# EAGLE design ESP-3212 breakout board (EAGLE 7.4.0)
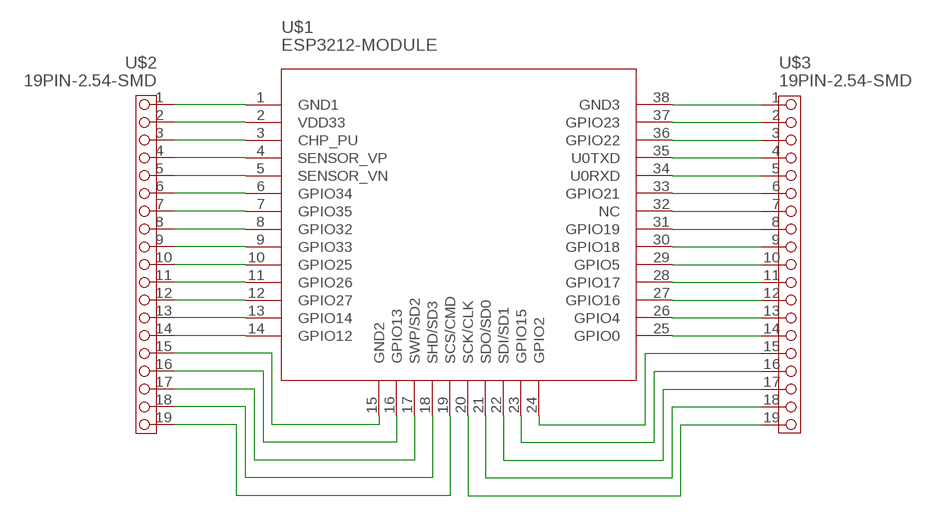
[diagram p0: schematic, sheet 1]

## Parts
U$1  ESP3212-MODULE  [ESP3212-MODULE]
U$2  19PIN-2.54-SMD  [19PIN-2.54-SMD]
U$3  19PIN-2.54-SMD  [19PIN-2.54-SMD]

## Nets
GND: U$1.1(GND1) U$1.15(GND2) U$1.38(GND3) U$2.1 U$2.15 U$3.1
N$2: U$1.2(VDD33) U$2.2
N$3: U$1.3(CHP_PU) U$2.3
N$4: U$1.4(SENSOR_VP) U$2.4
N$5: U$1.5(SENSOR_VN) U$2.5
N$6: U$1.6(GPIO34) U$2.6
N$7: U$1.7(GPIO35) U$2.7
N$8: U$1.8(GPIO32) U$2.8
N$9: U$1.9(GPIO33) U$2.9
N$10: U$1.10(GPIO25) U$2.10
N$11: U$1.11(GPIO26) U$2.11
N$12: U$1.12(GPIO27) U$2.12
N$13: U$1.13(GPIO14) U$2.13
N$14: U$1.14(GPIO12) U$2.14
N$16: U$1.16(GPIO13) U$2.16
N$17: U$1.17(SWP/SD2) U$2.17
N$18: U$1.18(SHD/SD3) U$2.18
N$19: U$1.19(SCS/CMD) U$2.19
N$21: U$1.37(GPIO23) U$3.2
N$22: U$1.36(GPIO22) U$3.3
N$23: U$1.35(U0TXD) U$3.4
N$24: U$1.34(U0RXD) U$3.5
N$25: U$1.33(GPIO21) U$3.6
N$26: U$1.32(NC) U$3.7
N$27: U$1.31(GPIO19) U$3.8
N$28: U$1.30(GPIO18) U$3.9
N$29: U$1.29(GPIO5) U$3.10
N$30: U$1.28(GPIO17) U$3.11
N$31: U$1.27(GPIO16) U$3.12
N$32: U$1.26(GPIO4) U$3.13
N$33: U$1.25(GPIO0) U$3.14
N$34: U$1.24(GPIO2) U$3.15
N$35: U$1.23(GPIO15) U$3.16
N$36: U$1.22(SDI/SD1) U$3.17
N$37: U$1.21(SDO/SD0) U$3.18
N$38: U$1.20(SCK/CLK) U$3.19

## Library data of the parts
U$1 = Bobby:ESP3212-MODULE
U$2 U$3 = Bobby:19PIN-2.54-SMD

## Net classes
2 gnd: width 0.305 mm, drill 0.559 mm, clearance 0.254 mm

## Board
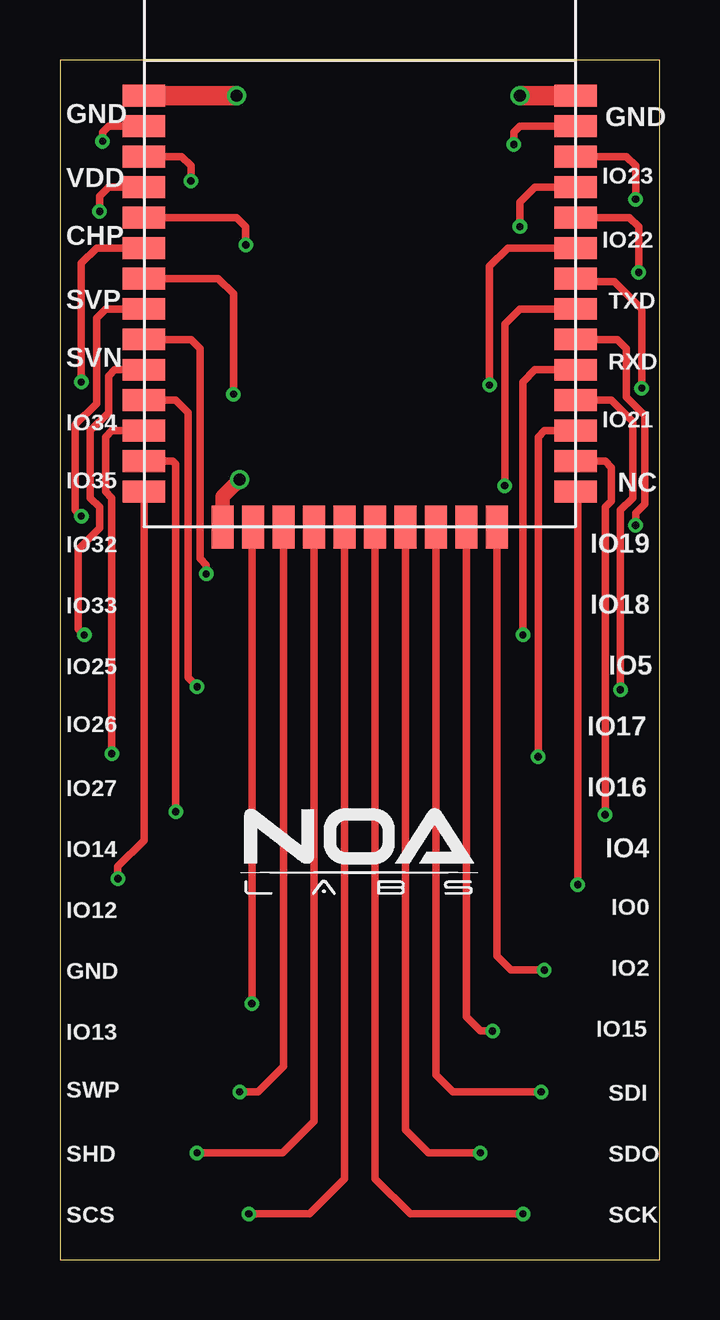
[diagram p1: board, top side]
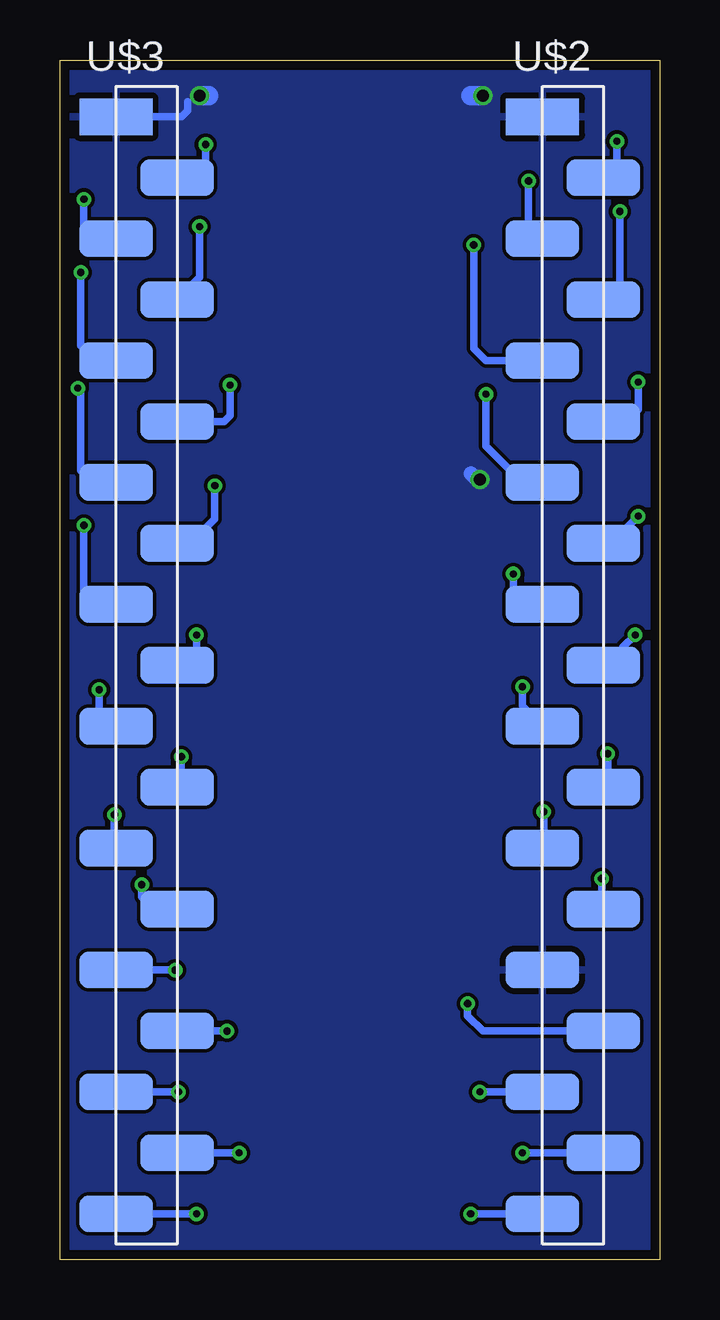
[diagram p2: board, bottom side, seen from below]

Size 25 x 50 mm. Coordinates in mm from the lower left corner, seen from the top.
Outline: 0,0 25,0 25,50 0,50 0,0
Copper layers (1*16): Top 0.035mm / dielectric 1.5mm / Bottom 0.035mm
Design rules "NOA Eagle Rule 2016-06-12": minimum track width 6mil, minimum drill 0.3mm, track to track 6mil, track to pad 6mil, pad to pad 6mil, via to via 6mil, smd to smd 0mil, copper to edge 0.4mm, drill to drill 10mil, minimum pad ring 10mil, minimum via ring 6mil, stop-mask expansion 2mil, vias tented up to drill 25mil, thermal gap 10mil

### Footprints (pad centres in the part's own frame; a part is rotated, then mirrored left to right if it is on the bottom)
ESP3212-MODULE = smd 1.778 x 0.914: 1 0,16.51; 2 0,15.24; 3 0,13.97; 4 0,12.7; 5 0,11.43; 6 0,10.16; 7 0,8.89; 8 0,7.62; 9 0,6.35; 10 0,5.08; 11 0,3.81; 12 0,2.54; 13 0,1.27; 14 0,0; 25 18,0; 26 18,1.27; 27 18,2.54; 28 18,3.81; 29 18,5.08; 30 18,6.35; 31 18,7.62; 32 18,8.89; 33 18,10.16; 34 18,11.43; 35 18,12.7; 36 18,13.97; 37 18,15.24; 38 18,16.51 | smd 0.914 x 1.778: 15 3.285,-1.47; 16 4.555,-1.47; 17 5.825,-1.47; 18 7.095,-1.47; 19 8.365,-1.47; 20 9.635,-1.47; 21 10.905,-1.47; 22 12.175,-1.47; 23 13.445,-1.47; 24 14.715,-1.47
19PIN-2.54-SMD = smd 3.048 x 1.524: 1 -1.27,24.13; 2 1.27,21.59; 3 -1.27,19.05; 4 1.27,16.51; 5 -1.27,13.97; 6 1.27,11.43; 7 -1.27,8.89; 8 1.27,6.35; 9 -1.27,3.81; 10 1.27,1.27; 11 -1.27,-1.27; 12 1.27,-3.81; 13 -1.27,-6.35; 14 1.27,-8.89; 15 -1.27,-11.43; 16 1.27,-13.97; 17 -1.27,-16.51; 18 1.27,-19.05; 19 -1.27,-21.59

### Placement (x,y rotation side)
U$1  3.5,32 0 top
U$2  3.61,23.5 0 bottom
U$3  21.39,23.5 0 bottom

### Tracks (layer width: path | path; a pad name or v marks a point on that pad's centre or on a via)
GND  (via drill 0.5)
  Top 0.305: 21.37,48.64 U$1.38
  Top 0.61: U$1.15 6.79,31.8 v7.49,32.51
  Top 0.813: U$1.1 v7.37,48.51 | U$1.38 v19.18,48.51
  Bottom 0.305: U$3.1 19.93,47.63 19.68,47.88 19.68,48.26
  Bottom 0.61: v7.49,32.51 7.62,32.51 7.87,32.77
  Bottom 0.813: v7.37,48.51 7.87,48.51 | v19.18,48.51 18.8,48.51
  pour Bottom: 0.25,49.53 24.77,49.53 24.77,0.25 0.25,0.25
N$2  (via drill 0.3)
  Top 0.305: U$1.2 2.03,47.24 1.78,46.99 v1.78,46.61
  Bottom 0.305: v1.78,46.61 1.78,45.65 U$2.2
N$3  (via drill 0.3)
  Top 0.305: U$1.3 5.08,45.97 5.46,45.59 v5.46,44.96
  Bottom 0.305: v5.46,44.96 5.46,42.67 5,42.67 U$2.3
N$4  (via drill 0.3)
  Top 0.305: U$1.4 2.03,44.7 1.65,44.32 v1.65,43.69
  Bottom 0.305: v1.65,43.69 1.65,40.01 1.78,39.88 2.21,39.88 U$2.4
N$5  (via drill 0.3)
  Top 0.305: U$1.5 7.37,43.43 7.75,43.05 v7.75,42.29
  Bottom 0.305: v7.75,42.29 7.75,37.97 7.24,37.47 U$2.5
N$6  (via drill 0.3)
  Top 0.305: U$1.6 1.52,42.16 0.89,41.53 v0.89,36.58
  Bottom 0.305: U$2.6 2.08,34.67 1.65,34.67 0.89,35.43 v0.89,36.58
N$7  (via drill 0.3)
  Top 0.305: U$1.7 6.6,40.89 7.24,40.26 v7.24,36.07
  Bottom 0.305: U$2.7 5.26,32.77 6.1,32.77 7.24,33.91 v7.24,36.07
N$8  (via drill 0.3)
  Top 0.305: v0.89,30.99 0.64,31.24 0.64,34.8 1.52,35.69 1.52,39.24 1.91,39.62 U$1.8
  Bottom 0.305: v0.89,30.99 1.78,30.1 2.09,30.1 U$2.8
N$9  (via drill 0.3)
  Top 0.305: U$1.9 5.46,38.35 5.84,37.97 5.84,29.21 6.1,28.96 v6.1,28.57
  Bottom 0.305: v6.1,28.57 6.1,27.56 5.84,27.3 U$2.9
N$10  (via drill 0.3)
  Top 0.305: U$1.10 2.29,37.08 2.03,36.83 2.03,35.31 1.27,34.54 1.27,31.75 1.65,31.37 1.65,30.48 0.76,29.59 0.76,26.29 v1.02,26.04
  Bottom 0.305: v1.02,26.04 1.52,25.53 1.52,24.89 1.78,24.64 2.21,24.64 U$2.10
N$11  (via drill 0.3)
  Top 0.305: U$1.11 4.83,35.81 5.33,35.31 5.33,24.26 v5.71,23.88
  Bottom 0.305: v5.71,23.88 5.71,23.07 U$2.11
N$12  (via drill 0.3)
  Top 0.305: U$1.12 2.16,34.54 1.91,34.29 1.91,32 2.16,31.75 v2.16,21.08
  Bottom 0.305: v2.16,21.08 2.16,19.87 U$2.12
N$13  (via drill 0.3)
  Top 0.305: U$1.13 4.7,33.27 4.83,33.15 v4.83,18.67
  Bottom 0.305: v4.83,18.67 4.83,17.2 U$2.13
N$14  (via drill 0.3)
  Top 0.305: U$1.14 3.5,17.47 2.41,16.38 v2.41,15.88
  Bottom 0.305: v2.41,15.88 2.41,14.68 U$2.14
N$16  (via drill 0.3)
  Top 0.305: v8,10.67 8,30.48 U$1.16
  Bottom 0.305: U$2.16 7.37,9.53 8,10.16 v8,10.67
N$17  (via drill 0.3)
  Top 0.305: U$1.17 9.32,8.05 8.26,6.99 v7.49,6.99
  Bottom 0.305: v7.49,6.99 U$2.17
N$18  (via drill 0.3)
  Top 0.305: U$1.18 10.6,5.77 9.27,4.45 v5.71,4.45
  Bottom 0.305: v5.71,4.45 U$2.18
N$19  (via drill 0.3)
  Top 0.305: U$1.19 11.87,3.36 10.41,1.91 v7.87,1.91
  Bottom 0.305: v7.87,1.91 U$2.19
N$21  (via drill 0.3)
  Top 0.305: U$1.37 19.18,47.24 18.92,46.99 v18.92,46.48
  Bottom 0.305: v18.92,46.48 18.92,45.47 19.05,45.34 19.87,45.34 U$3.2
N$22  (via drill 0.3)
  Top 0.305: U$1.36 23.62,45.97 24,45.59 v24,44.2
  Bottom 0.305: v24,44.2 24,42.93 23.62,42.55 U$3.3
N$23  (via drill 0.3)
  Top 0.305: U$1.35 19.81,44.7 19.18,44.07 v19.18,43.05
  Bottom 0.305: v19.18,43.05 19.18,40.95 U$3.4
N$24  (via drill 0.3)
  Top 0.305: U$1.34 23.75,43.43 24.13,43.05 v24.13,41.15
  Bottom 0.305: v24.13,41.15 24.13,38.1 23.62,37.59 22.78,37.59 U$3.5
N$25  (via drill 0.3)
  Top 0.305: U$1.33 18.67,42.16 17.91,41.4 v17.91,36.45
  Bottom 0.305: v17.91,36.45 17.91,35.18 18.16,34.92 U$3.6
N$26  (via drill 0.3)
  Top 0.305: v24.26,36.32 24.26,39.62 23.11,40.77 21.63,40.77 U$1.32
  Bottom 0.305: v24.26,36.32 24.13,36.2 24.13,32.89 23.5,32.26 22.79,32.26 U$3.7
N$27  (via drill 0.3)
  Top 0.305: U$1.31 19.18,39.62 18.54,38.99 v18.54,32.26
  Bottom 0.305: v18.54,32.26 18.54,30.86 19.43,29.97 20,29.97 U$3.8
N$28  (via drill 0.3)
  Top 0.305: U$1.30 23.24,38.35 23.62,37.97 23.62,35.94 24.38,35.18 24.38,31.5 24,31.11 v24,30.61
  Bottom 0.305: v24,30.61 24,27.43 23.5,26.92 23.05,26.92 U$3.9
N$29  (via drill 0.3)
  Top 0.305: U$1.29 19.81,37.08 19.3,36.58 v19.3,26.04
  Bottom 0.305: v19.3,26.04 19.3,24.89 19.56,24.64 19.99,24.64 U$3.10
N$30  (via drill 0.3)
  Top 0.305: U$1.28 22.99,35.81 23.88,34.92 23.88,31.75 23.37,31.24 v23.37,23.75
  Bottom 0.305: v23.37,23.75 23.37,22.94 U$3.11
N$31  (via drill 0.3)
  Top 0.305: U$1.27 20.19,34.54 19.94,34.29 v19.94,20.95
  Bottom 0.305: v19.94,20.95 19.94,19.87 U$3.12
N$32  (via drill 0.3)
  Top 0.305: U$1.26 22.73,33.27 22.99,33.02 22.99,31.62 22.73,31.37 v22.73,18.54
  Bottom 0.305: v22.73,18.54 22.73,17.22 U$3.13
N$33  (via drill 0.3)
  Top 0.305: v21.59,15.62 21.59,31.91 U$1.25
  Bottom 0.305: U$3.14 21.09,14.61 21.59,15.11 v21.59,15.62
N$34  (via drill 0.3)
  Top 0.305: U$1.24 18.21,12.65 18.8,12.06 v20.19,12.06
  Bottom 0.305: v20.19,12.06 U$3.15
N$35  (via drill 0.3)
  Top 0.305: U$1.23 16.95,10.11 17.53,9.53 v18.03,9.53
  Bottom 0.305: v18.03,9.53 U$3.16
N$36  (via drill 0.3)
  Top 0.305: U$1.22 15.68,7.69 16.38,6.99 v20.07,6.99
  Bottom 0.305: v20.07,6.99 U$3.17 | 23.75,6.99 U$3.17 | U$3.17
N$37  (via drill 0.3)
  Top 0.305: U$1.21 14.4,5.41 15.37,4.45 v17.53,4.45
  Bottom 0.305: v17.53,4.45 U$3.18
N$38  (via drill 0.3)
  Top 0.305: U$1.20 13.13,3.38 14.61,1.91 v19.3,1.91
  Bottom 0.305: v19.3,1.91 U$3.19

### Text on the board
tPlace: GND | GND | VDD | IO23 | CHP | IO22 | SVP | TXD | SVN | RXD | IO34 | IO21 | IO35 | NC | IO32 | IO19 | IO33 | IO18 | IO25 | IO5 | IO26 | IO17 | IO27 | IO16 | IO14 | IO4 | IO12 | IO0 | GND | IO2 | IO13 | IO15 | SWP | SDI | SHD | SDO | SCS | SCK